# EAGLE design FonteDeTensao (EAGLE 9.6.2)
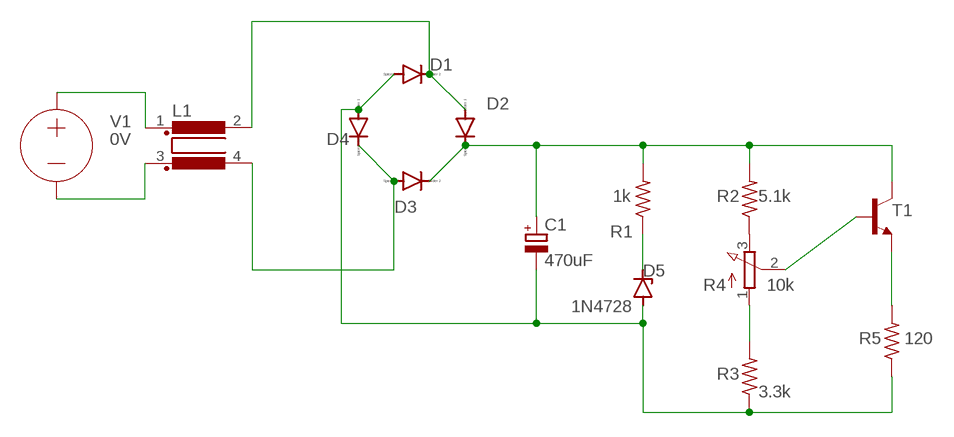
[diagram p0: schematic, sheet 1]

## Parts
C1  470uF  CPOL-EUE2,5-6E  [E2,5-6E]
D1  1N4004  [DO41-10]
D2  1N4004  [DO41-10]
D3  1N4004  [DO41-10]
D4  1N4004  [DO41-10]
D5  1N4728  [DO41Z10]
L1  R1405VB1  [B1]
R1  1k  R-US_0411/12  [0411/12]
R2  5.1k  R-US_0411/12  [0411/12]
R3  3.3k  R-US_0411/12  [0411/12]
R4  10k  3RP/1610N  [3RP/1610N]
R5  120  R-US_0411/12  [0411/12]
T1  BC337-16-NPN-TO92-CBE  [TO92-CBE]
V1  0V  VOLTAGE  (no package)

## Nets
N$1: D1.C D2.A L1.2
N$2: C1.+ D2.C D3.C R1.2 R2.2 T1.C
N$3: D3.A D4.C L1.4
N$4: C1.- D1.A D4.A D5.A R3.1 R5.1
N$5: R2.1 R3.2 R4.1(A) R4.2(S) R4.3(E) T1.B
N$6: D5.C R1.1
N$7: R5.2 T1.E
N$8: L1.3 V1.-
N$9: L1.1 V1.+

## Library data of the parts
C1 = rcl:CPOL-EU: POLARIZED CAPACITOR, European symbol; SPICEPREFIX: C
D1-D4 = diode:1N4004: DIODE general purpose rectifier, 1 A
D5 = diode:1N4728: Z DIODE 3.3 V, 1W, 5 percent
L1 = inductor-nkl:R1405V: Übertrager (verlustarm) bis typ. 400kHz Power transformer (low loss) up to typ. 400kHz; OC_FARNELL: unknown; OC_NEWARK: unknown
R1-R3 R5 = rcl:R-US_: RESISTOR, American symbol; SPICEPREFIX: R
R4 = pot:3RP/1610N: 16mm Potentiometer one level Source: http://www.alphapotentiometers.net/html/16mm_pot_2.html
T1 = transistor:*-NPN-: NPN Transistror BF959 corrected 2008.03.06
V1 = ngspice-simulation:VOLTAGE: Independent Voltage Source, either DC, AC, PULSE, SINE, PWL, EXP, or SFFM

## Board
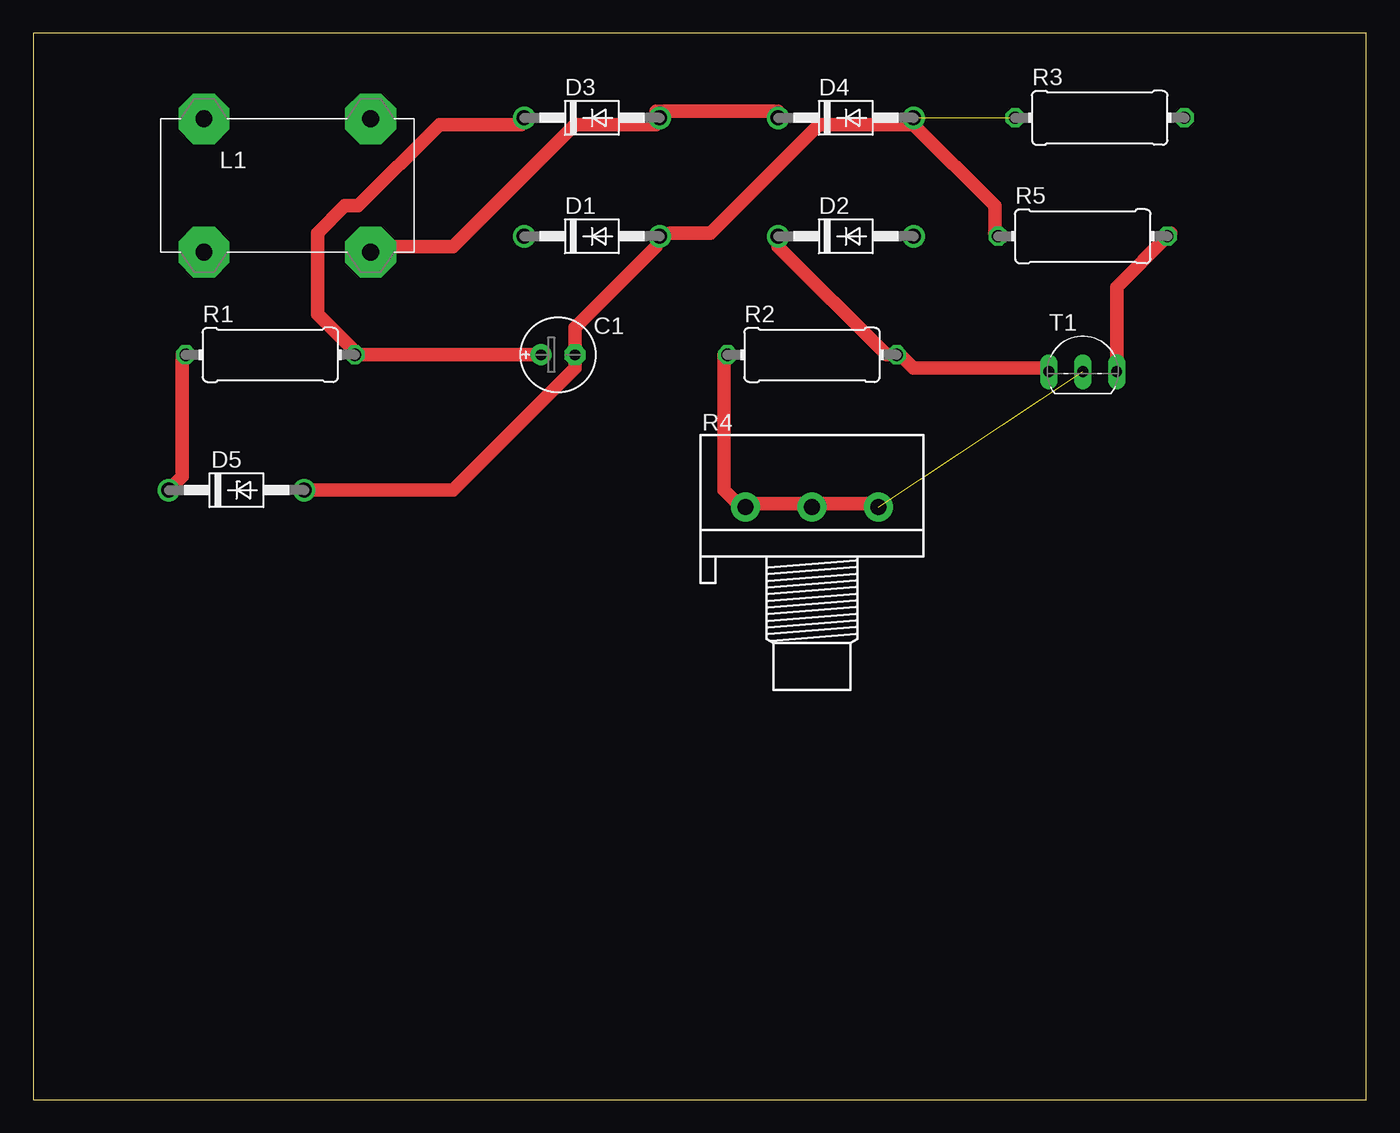
[diagram p1: board, top side]
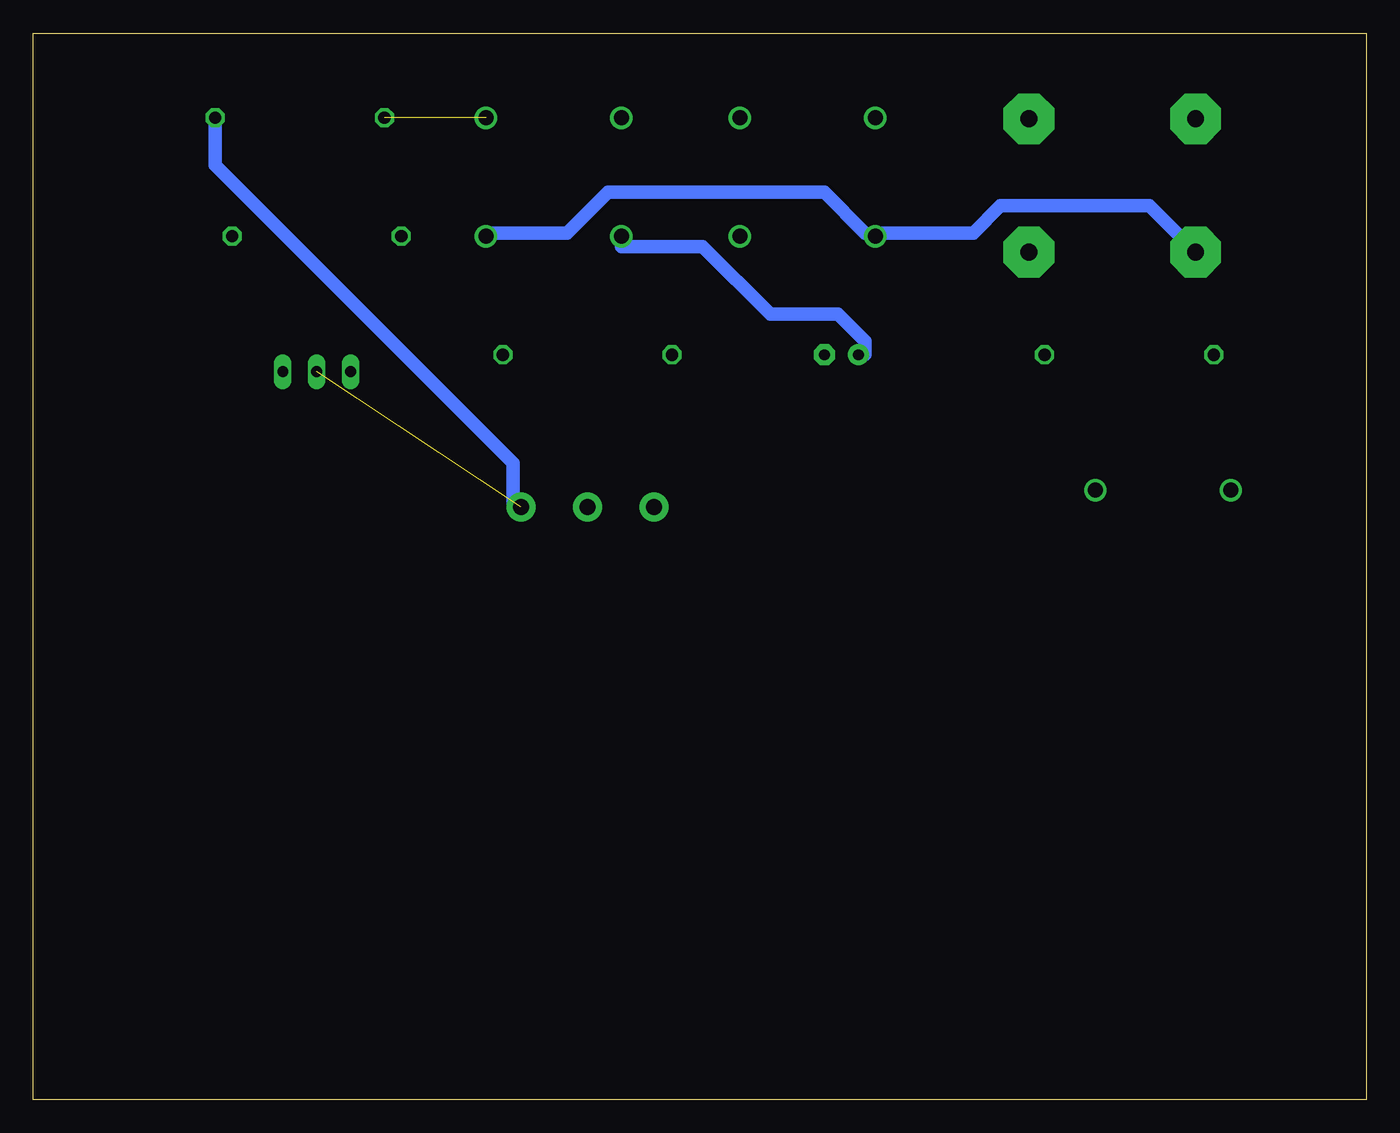
[diagram p2: board, bottom side, seen from below]

Size 100 x 80 mm. Coordinates in mm from the lower left corner, seen from the top.
Outline: 0,0 100,0 100,80 0,80 0,0
Copper layers (1*16): Top 0.035mm / dielectric 1.5mm / Bottom 0.035mm
Design rules "default *": minimum track width 40mil, minimum drill 0.35mm, track to track 40mil, track to pad 40mil, pad to pad 40mil, via to via 40mil, smd to smd 6mil, copper to edge 40mil, drill to drill 6mil, minimum pad ring 10mil, minimum via ring 8mil, stop-mask expansion 4mil, vias tented up to drill 0mil, thermal gap 10mil

### Footprints (pad centres in the part's own frame; a part is rotated, then mirrored left to right if it is on the bottom)
E2,5-6E = drill 0.813 pad 1.575: + -1.27,0 | drill 0.813 pad 1.575 octagon: - 1.27,0
DO41-10 = drill 1.118: A 5.08,0; C -5.08,0
DO41Z10 = drill 1.118: A 5.08,0; C -5.08,0
B1 = drill 1.27 pad 3.81 octagon: 1 -6.25,5; 2 -6.25,-5; 3 6.25,5; 4 6.25,-5
0411/12 = drill 0.914 octagon: 1 -6.35,0; 2 6.35,0
3RP/1610N = drill 1.2 pad 2.184: 1 -5,0; 2 0,0; 3 5,0
TO92-CBE = drill 0.813 long: B 0,0; C -2.54,0; E 2.54,0

### Placement (x,y rotation side)
C1  39.37,55.88 0 top
D1  41.91,64.77 0 top
D2  60.96,64.77 0 top
D3  41.91,73.66 0 top
D4  60.96,73.66 0 top
D5  15.24,45.72 0 top
L1  19.05,68.58 0 top
R1  17.78,55.88 0 top
R2  58.42,55.88 0 top
R3  80.01,73.66 0 top
R4  58.42,44.45 0 top
R5  78.74,64.77 0 top
T1  78.74,54.61 0 top

### Tracks (layer width: path | path; a pad name or v marks a point on that pad's centre or on a via)
N$1
  Bottom 1.016: L1.2 13.21,64.01 16.26,67.06 27.43,67.06 29.46,65.02 36.58,65.02 D1.C 37.59,65.02 40.64,68.07 56.9,68.07 59.94,65.02 66.04,65.02 D2.A
N$2
  Top 1.016: T1.C 76.2,54.86 66.04,54.86 65.02,55.88 R2.2 64.01,55.88 55.88,64.01 D2.C | C1.+ 24.38,55.88 | 24.38,55.88 21.34,58.93 21.34,65.02 23.37,67.06 24.38,67.06 30.48,73.15 36.58,73.15 D3.C | 24.38,55.88 R1.2
  Bottom 1.016: D2.C 55.88,64.01 49.78,64.01 44.7,58.93 39.62,58.93 37.59,56.9 37.59,55.88 C1.+
N$3
  Top 1.016: D4.C 55.88,74.17 46.74,74.17 D3.A 46.74,73.15 40.64,73.15 31.5,64.01 25.4,64.01 L1.4
N$4  (1 unrouted)
  Top 1.016: 66.04,73.15 72.14,67.06 72.14,65.02 R5.1 | D5.A 31.5,45.72 40.64,54.86 C1.- 40.64,57.91 46.74,64.01 D1.A 47.75,65.02 50.8,65.02 58.93,73.15 66.04,73.15 | 66.04,73.15 D4.A
N$5  (1 unrouted)
  Top 1.016: R2.1 51.82,55.88 51.82,45.72 52.83,44.7 R4.1 53.85,44.7 57.91,44.7 R4.2 58.93,44.7 62.99,44.7 R4.3
  Bottom 1.016: R3.2 86.36,70.1 64.01,47.75 64.01,44.7 R4.3
N$6
  Top 1.016: D5.C 11.18,46.74 11.18,55.88 R1.1
N$7
  Top 1.016: T1.E 81.28,60.96 R5.2 85.34,65.02